# EAGLE design Iridium 9603N Test Header (EAGLE 9.4.1)
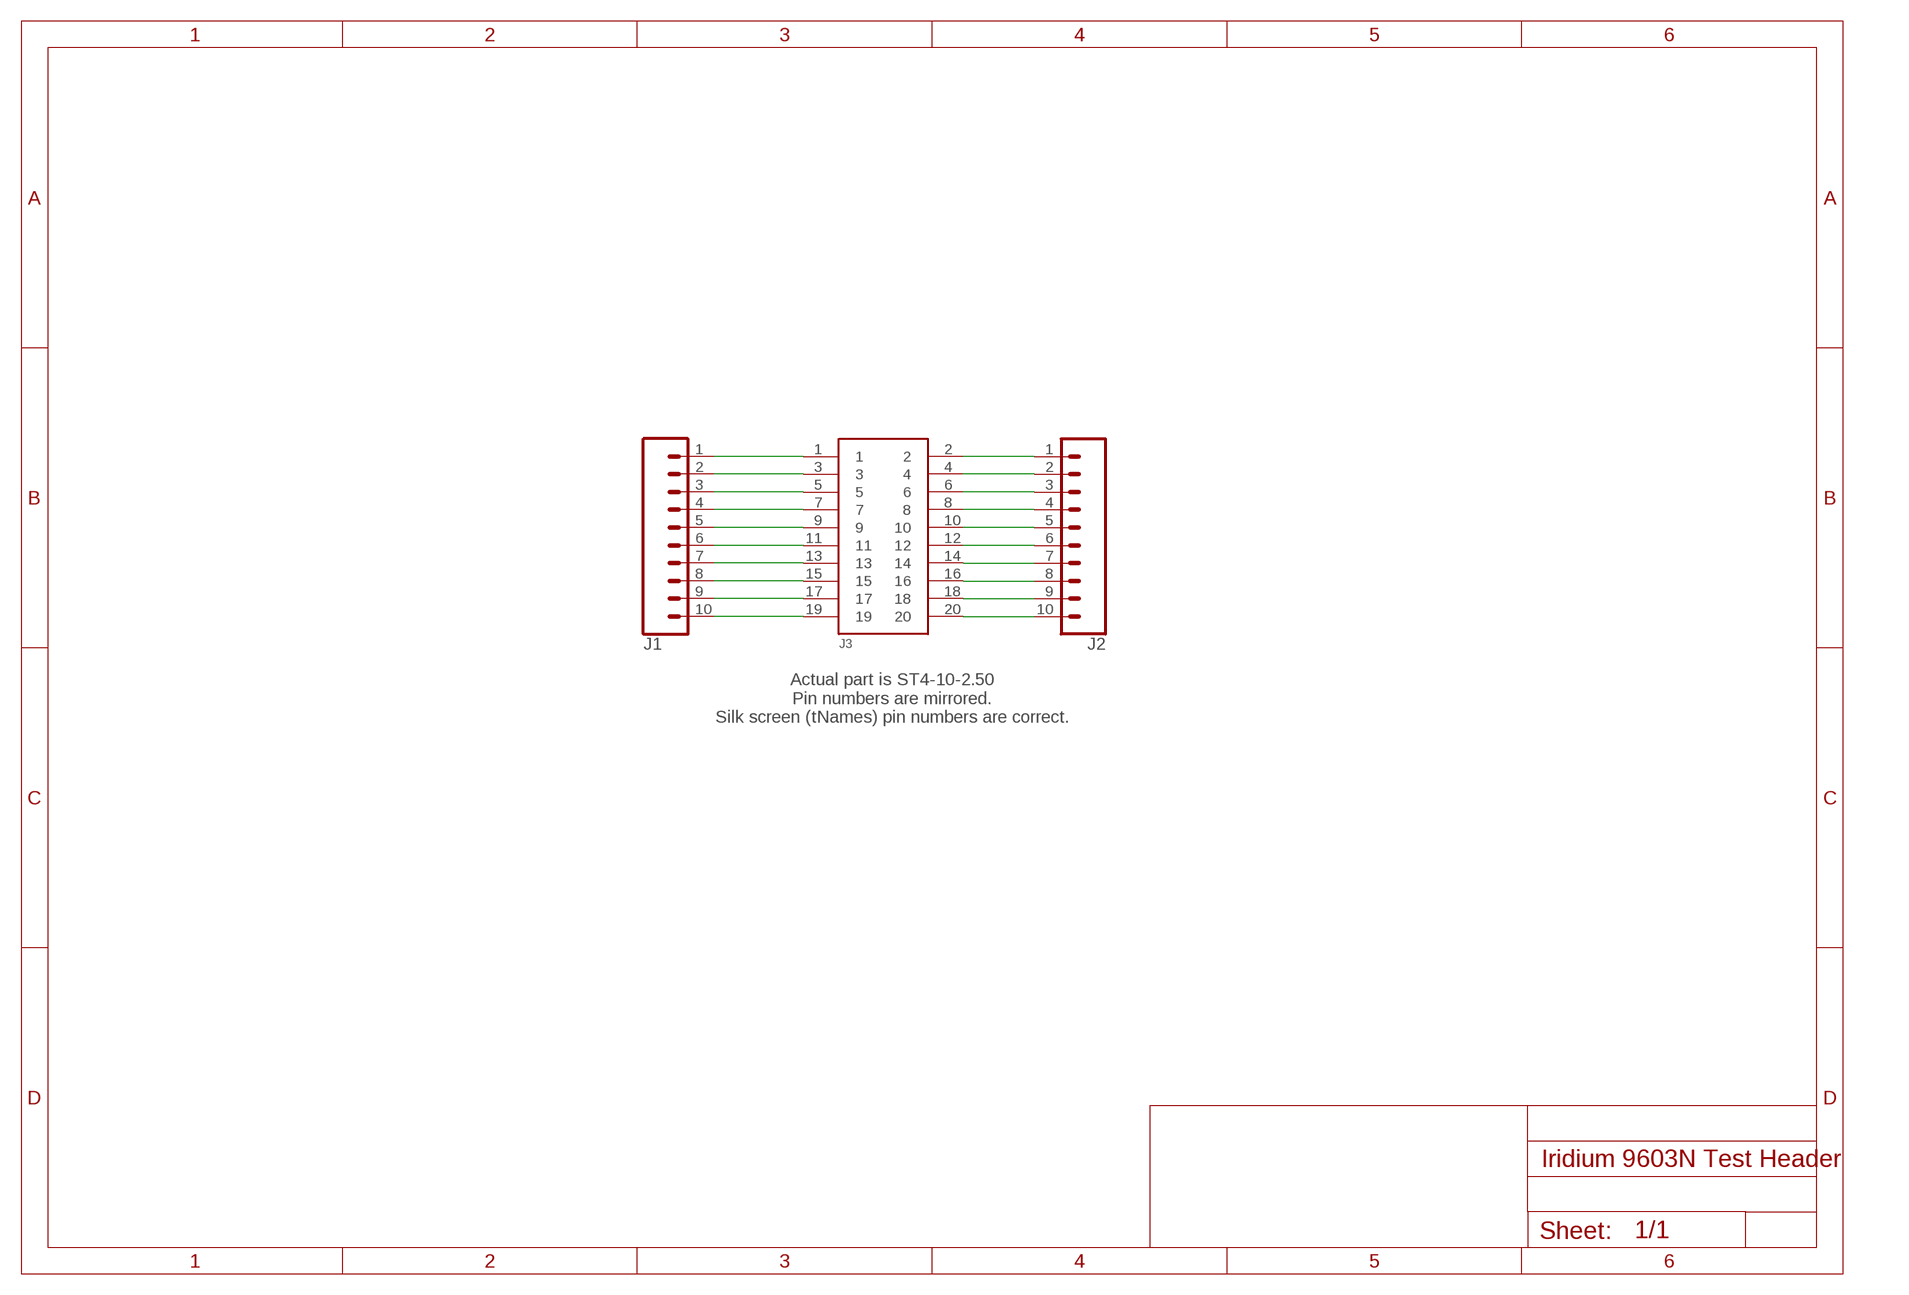
[diagram p0: schematic, sheet 1]

## Parts
J1  CONN_10"  [1X10]
J2  CONN_10"  [1X10]
J3  SS4-10-3.50-X-D  [SS4-10-3.50-X-D]

## Nets
N$1: J1.1 J3.1
N$2: J1.2 J3.3
N$3: J1.3 J3.5
N$4: J1.4 J3.7
N$5: J1.5 J3.9
N$6: J1.6 J3.11
N$7: J1.7 J3.13
N$8: J1.8 J3.15
N$9: J1.9 J3.17
N$10: J1.10 J3.19
N$11: J2.10 J3.20
N$12: J2.9 J3.18
N$13: J2.8 J3.16
N$14: J2.7 J3.14
N$15: J2.6 J3.12
N$16: J2.5 J3.10
N$17: J2.4 J3.8
N$18: J2.3 J3.6
N$19: J2.2 J3.4
N$20: J2.1 J3.2

## Notes on the sheet
- Actual part is ST4-10-2.50
  Pin numbers are mirrored.
  Silk screen (tNames) pin numbers are correct.

## Library data of the parts
J1 J2 = SparkFun-Connectors:CONN_10: Multi connection point. Often used as Generic Header-pin footprint for 0.1 inch spaced/style header connections On any of the 0.1 inch spaced packages, you can populate with these: Break Away Headers - Straight <https://www.sparkfun.com/products/116> (PRT-00116) Break Away Male Headers - Right Angle <https://www.sparkfun.com/products/553> (PRT-00553) Female Headers <https://www.sparkfun.com/products/115> (PRT-00115) Break Away Headers - Machine Pin <https://www.sparkfun.com/products/117> (PRT-00117) Break Away Female Headers - Swiss Machine Pin <https://www.sparkfun.com/products/743> (PRT-00743) Arduino Stackable Header - 10 Pin <https://www.sparkfun.com/products/11376> (PRT-11376) For SCREWTERMINALS and SPRING TERMINALS visit here: Screw Terimnals on SparkFun.com <https://www.sparkfun.com/search/results?term=Screw+Terminals> (5mm/3.5mm/2.54mm spacing) This device is also useful as a general connection point to wire up your design to another part of your project. Our various solder wires solder well into these plated through hole pads. Hook-Up Wire - Assortment (Stranded, 22 AWG) <https://www.sparkfun.com/products/11375> (PRT-11375) Hook-Up Wire - Assortment (Solid Core, 22 AWG) <https://www.sparkfun.com/products/11367> (PRT-11367) View the entire wire category on our website here <https://www.sparkfun.com/categories/141> Special notes: Molex polarized connector foot print use with SKU : PRT-08231 with associated crimp pins and housings. 1MM SMD Version SKU: PRT-10208 NOTES ON THE VARIANTS LOCK and LOCK_LONGPADS... This footprint was designed to help hold the alignment of a through-hole component (i.e. 6-pin header) while soldering it into place. You may notice that each hole has been shifted either up or down by 0.005 of an inch from it's more standard position (which is a perfectly straight line). This slight alteration caused the pins (the squares in the middle) to touch the edges of the holes. Because they are alternating, it causes a "brace" to hold the component in place. 0.005 has proven to be the perfect amount of "off-center" position when using our standard breakaway headers. Although looks a little odd when you look at the bare footprint, once you have a header in there, the alteration is very hard to notice. Also,if you push a header all the way into place, it is covered up entirely on the bottom side.; PROD_ID: CONN-11563
J3 = Iridium 9603N Test Header:SS4-10-3.50-X-D: 0.4mm[.016] SOCKET STRIP ASSEMBLY.

## Board
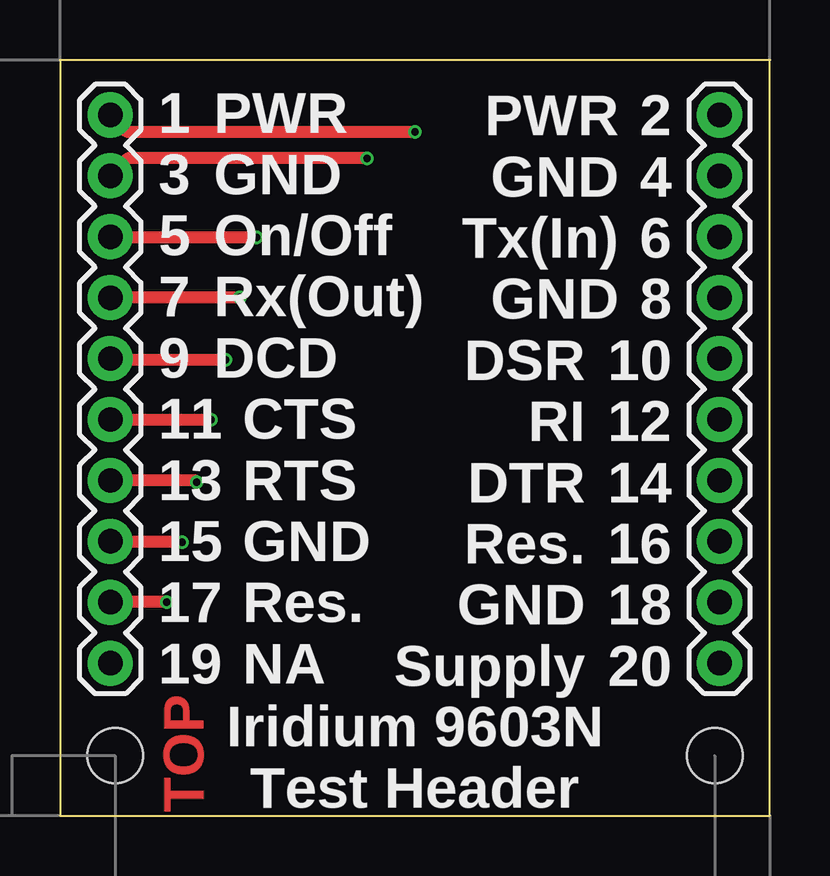
[diagram p1: board, top side]
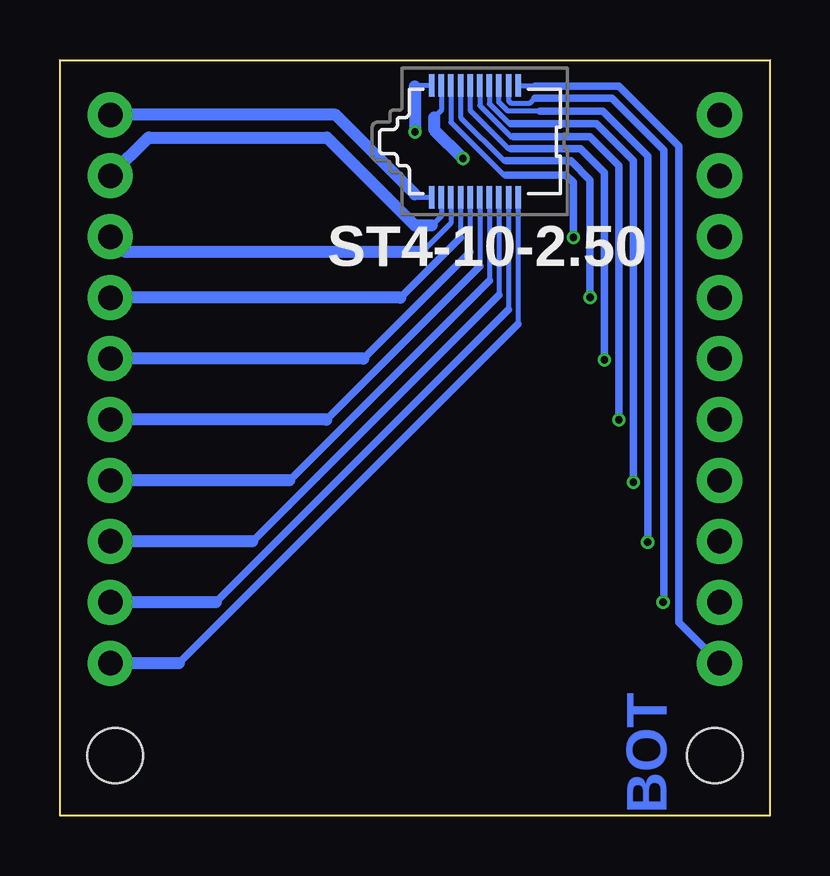
[diagram p2: board, bottom side, seen from below]

Size 29.6 x 31.5 mm. Coordinates in mm from the lower left corner, seen from the top.
Outline: 0,0 29.6,0 29.6,31.5 0,31.5 0,0
Copper layers (1*16): Top 0.018mm / dielectric 1.55mm / Bottom 0.018mm
Design rules "Multi-CB_2L_125um-Tracks_OL35um": minimum track width 0.125mm, minimum drill 0.2mm, track to track 0.125mm, track to pad 0.125mm, pad to pad 0.125mm, via to via 0.125mm, smd to smd 0mil, copper to edge 0.2mm, drill to drill 0.2mm, minimum pad ring 0.125mm, minimum via ring 0.125mm, stop-mask expansion 2mil, vias tented up to drill 0.45mm, thermal gap 0.2mm
Holes 2.3 mm at 2.3,2.5 27.3,2.5

### Footprints (pad centres in the part's own frame; a part is rotated, then mirrored left to right if it is on the bottom)
1X10 = drill 1.016 pad 1.88: 1 0,0; 2 2.54,0; 3 5.08,0; 4 7.62,0; 5 10.16,0; 6 12.7,0; 7 15.24,0; 8 17.78,0; 9 20.32,0; 10 22.86,0
SS4-10-3.50-X-D = smd 0.23 x 0.93: 1 1.8,2.335; 2 1.8,-2.335; 3 1.4,2.335; 4 1.4,-2.335; 5 1,2.335; 6 1,-2.335; 7 0.6,2.335; 8 0.6,-2.335; 9 0.2,2.335; 10 0.2,-2.335; 11 -0.2,2.335; 12 -0.2,-2.335; 13 -0.6,2.335; 14 -0.6,-2.335; 15 -1,2.335; 16 -1,-2.335; 17 -1.4,2.335; 18 -1.4,-2.335; 19 -1.8,2.335; 20 -1.8,-2.335

### Placement (x,y rotation side)
J1  27.5,29.21 270 top
J2  2.1,29.21 270 top
J3  12.3,28.1 180 bottom

### Tracks (layer width: path | path; a pad name or v marks a point on that pad's centre or on a via)
N$1
  Bottom 0.203: J3.1 14.66,25.77 14.8,25.9
  Bottom 0.508: 14.8,25.9 18.11,29.21 J1.1
N$2
  Bottom 0.203: J3.3 13.7,25 14.1,24.6
  Bottom 0.508: 14.1,24.6 14.8,24.6 18.47,28.27 25.9,28.27 J1.2
N$3
  Bottom 0.203: J3.5 13.3,24.7 14.5,23.5
  Bottom 0.508: 14.5,23.5 26.87,23.5 J1.3
N$4
  Bottom 0.203: J3.7 12.9,24.1
  Bottom 0.305: 12.9,24.1 15.41,21.59
  Bottom 0.508: 15.41,21.59 J1.4
N$5
  Bottom 0.203: J3.9 12.5,23.5
  Bottom 0.305: 12.5,23.5 16.95,19.05
  Bottom 0.508: 16.95,19.05 J1.5
N$6
  Bottom 0.203: J3.11 12.1,22.9
  Bottom 0.305: 12.1,22.9 18.49,16.51
  Bottom 0.508: 18.49,16.51 J1.6
N$7
  Bottom 0.203: J3.13 11.7,22.3
  Bottom 0.305: 11.7,22.3 20.03,13.97
  Bottom 0.508: 20.03,13.97 J1.7
N$8
  Bottom 0.203: J3.15 11.3,21.7
  Bottom 0.305: 11.3,21.7 21.57,11.43
  Bottom 0.508: 21.57,11.43 J1.8
N$9
  Bottom 0.203: J3.17 10.9,21.1
  Bottom 0.305: 10.9,21.1 23.11,8.89
  Bottom 0.508: 23.11,8.89 J1.9
N$10
  Bottom 0.203: J3.19 10.5,20.5
  Bottom 0.305: 10.5,20.5 24.65,6.35
  Bottom 0.508: 24.65,6.35 J1.10
N$11
  Bottom 0.203: J3.20 9.84,30.43 9.8,30.4
  Bottom 0.305: 9.8,30.4 6.3,30.4 3.8,27.9 3.8,8.05 J2.10
N$12  (via drill 0.3)
  Top 0.508: v4.45,8.9 J2.9
  Bottom 0.203: J3.18 10.9,29.8 10.8,29.7 10,29.7 9.8,29.9
  Bottom 0.305: 9.8,29.9 6.6,29.9 4.43,27.73 4.43,8.92
  Bottom 0.508: 4.43,8.92 v4.45,8.9
N$13  (via drill 0.3)
  Top 0.508: J2.8 5.07,11.43 v5.1,11.4
  Bottom 0.203: 9.6,29.37 10.93,29.37 11.3,29.74 J3.16
  Bottom 0.305: v5.1,11.4 5.1,27.5 6.97,29.37 9.6,29.37
N$14  (via drill 0.3)
  Top 0.508: v5.7,13.9 5.63,13.97 J2.7
  Bottom 0.203: 10.8,28.84 10.87,28.84 11.7,29.67 J3.14
  Bottom 0.305: 10.8,28.84 7.24,28.84 5.7,27.3 v5.7,13.9
N$15  (via drill 0.3)
  Top 0.508: v6.3,16.5 J2.6
  Bottom 0.203: J3.12 12.1,29.6 10.8,28.3 10.7,28.3
  Bottom 0.305: 10.7,28.3 7.5,28.3 6.3,27.1 v6.3,16.5
N$16  (via drill 0.3)
  Top 0.508: v6.9,19 2.15,19 J2.5
  Bottom 0.203: J3.10 12.5,29.4 10.9,27.8 10.8,27.8
  Bottom 0.305: 10.8,27.8 7.9,27.8 6.9,26.8 v6.9,19
N$17  (via drill 0.3)
  Top 0.305: J2.4
  Top 0.508: v7.5,21.6 J2.4
  Bottom 0.203: J3.8 12.9,29.1 11.1,27.3 11,27.3
  Bottom 0.305: 11,27.3 8.3,27.3 7.5,26.5 v7.5,21.6
N$18  (via drill 0.3)
  Top 0.305: 2.13,24.1 J2.3
  Top 0.508: v8.2,24.1 2.13,24.1
  Bottom 0.203: J3.6 13.3,28.9 11.1,26.7 11,26.7
  Bottom 0.305: 11,26.7 8.5,26.7 8.2,26.4 v8.2,24.1
N$19  (via drill 0.3)
  Top 0.508: v12.8,27.4 2.83,27.4 J2.2
  Bottom 0.203: J3.4 13.7,29.4 14,29.1
  Bottom 0.508: 14,29.1 14,28.6 v12.8,27.4
N$20  (via drill 0.3)
  Top 0.508: v14.8,28.5 2.81,28.5 J2.1
  Bottom 0.203: J3.2 14.77,30.43 14.8,30.4
  Bottom 0.508: 14.8,30.4 v14.8,28.5

### Text on the board
Top: TOP
Bottom: BOT
tNames: 1 / 3 / 5 / 7 / 9 / 11 / 13 / 15 / 17 / 19 | PWR / GND / On/Off / Rx(Out) / DCD | CTS / RTS / GND / Res. / NA | DSR / RI / DTR / Res. / GND / Supply | PWR / GND / Tx(In) / GND | 2 / 4 / 6 / 8 / 10 / 12 / 14 / 16 / 18 / 20 | Iridium 9603N / Test Header
bNames: ST4-10-2.50